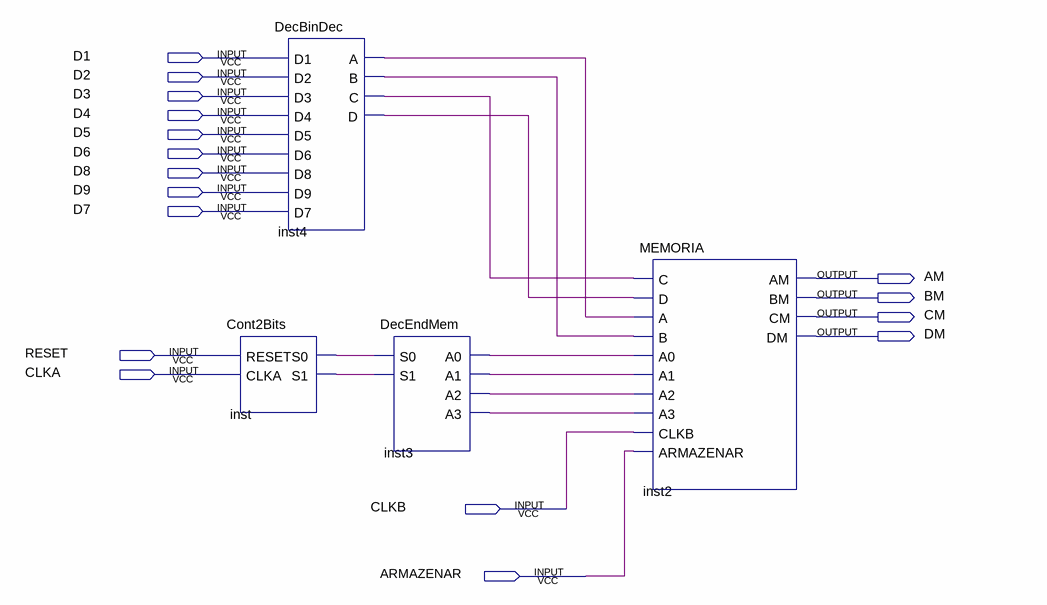
[diagram p0: schematic sheet]
// Quartus schematic LogicaMemoria.bdf as structural Verilog: 4 symbols, 17 pins
module LogicaMemoria (
  input  D1,
  input  D2,
  input  D3,
  input  D4,
  input  D5,
  input  D6,
  input  D8,
  input  D9,
  input  D7,
  input  RESET,
  input  CLKA,
  input  CLKB,
  input  ARMAZENAR,
  output AM,
  output BM,
  output CM,
  output DM
);

  wire inst3_a0, inst3_a1, inst3_a2, inst3_a3, inst4_a, inst4_b, inst4_c, inst4_d, inst_s0, inst_s1;

  Cont2Bits inst (.RESET(RESET), .CLKA(CLKA), .S0(inst_s0), .S1(inst_s1));
  DecBinDec inst4 (
    .D1(D1), .D2(D2), .D3(D3), .D4(D4), .D5(D5), .D6(D6), .D8(D8), .D9(D9), .D7(D7), .A(inst4_a),
    .B(inst4_b), .C(inst4_c), .D(inst4_d));
  DecEndMem inst3 (.S0(inst_s0), .S1(inst_s1), .A0(inst3_a0), .A1(inst3_a1), .A2(inst3_a2), .A3(inst3_a3));
  MEMORIA inst2 (
    .C(inst4_c), .D(inst4_d), .A(inst4_a), .B(inst4_b), .A0(inst3_a0), .A1(inst3_a1), .A2(inst3_a2),
    .A3(inst3_a3), .CLKB(CLKB), .ARMAZENAR(ARMAZENAR), .AM(AM), .BM(BM), .CM(CM), .DM(DM));
endmodule
